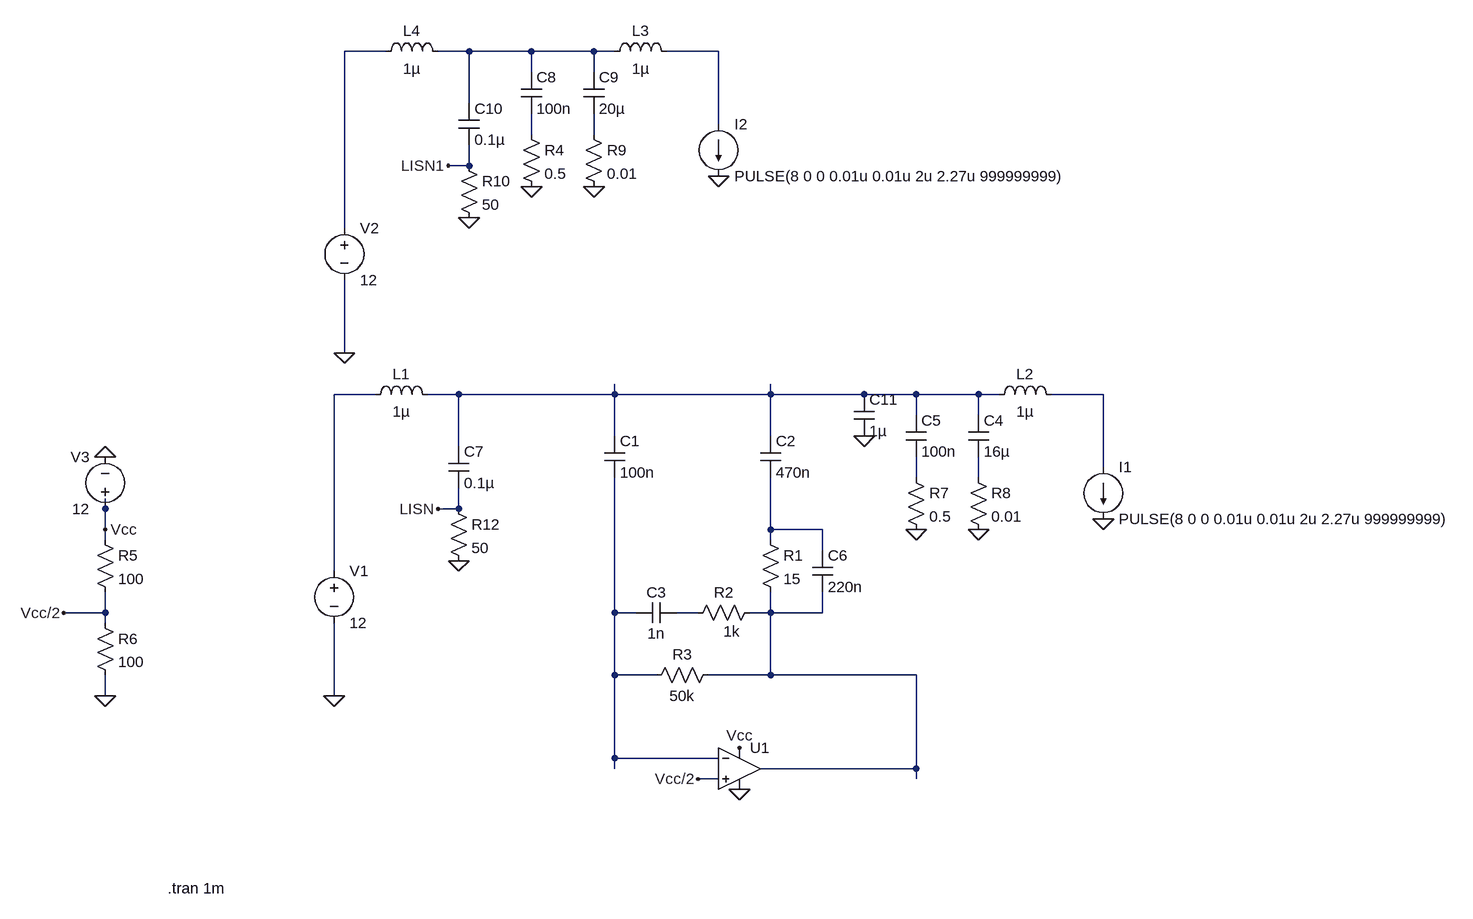
[diagram p0: schematic 440kHz.asc]
440kHz.asc, the LTspice schematic file:
Version 4
SHEET 1 3444 680
WIRE -320 -656 -384 -656
WIRE -192 -656 -240 -656
WIRE -96 -656 -192 -656
WIRE 0 -656 -96 -656
WIRE 32 -656 0 -656
WIRE 192 -656 112 -656
WIRE -96 -624 -96 -656
WIRE 0 -624 0 -656
WIRE -192 -576 -192 -656
WIRE 192 -544 192 -656
WIRE -96 -528 -96 -560
WIRE 0 -528 0 -560
WIRE -192 -480 -192 -512
WIRE -192 -480 -224 -480
WIRE -384 -384 -384 -656
WIRE -384 -192 -384 -304
WIRE -336 -128 -400 -128
WIRE -208 -128 -256 -128
WIRE 32 -128 32 -144
WIRE 32 -128 -208 -128
WIRE 272 -128 272 -144
WIRE 272 -128 32 -128
WIRE 416 -128 272 -128
WIRE 496 -128 416 -128
WIRE 592 -128 496 -128
WIRE 624 -128 592 -128
WIRE 784 -128 704 -128
WIRE 496 -96 496 -128
WIRE 592 -96 592 -128
WIRE 32 -64 32 -128
WIRE 272 -64 272 -128
WIRE -208 -48 -208 -128
WIRE 784 -16 784 -128
WIRE 496 0 496 -32
WIRE 592 0 592 -32
WIRE -752 48 -752 32
WIRE -208 48 -208 16
WIRE -208 48 -240 48
WIRE -752 80 -752 48
WIRE 272 80 272 0
WIRE 352 80 272 80
WIRE -752 96 -752 80
WIRE 272 96 272 80
WIRE 352 112 352 80
WIRE -400 144 -400 -128
WIRE -752 208 -752 176
WIRE -752 208 -816 208
WIRE 32 208 32 0
WIRE 64 208 32 208
WIRE 160 208 128 208
WIRE 272 208 272 176
WIRE 272 208 240 208
WIRE 352 208 352 176
WIRE 352 208 272 208
WIRE -752 224 -752 208
WIRE 32 304 32 208
WIRE 96 304 32 304
WIRE 272 304 272 208
WIRE 272 304 176 304
WIRE 496 304 272 304
WIRE -752 336 -752 304
WIRE -400 336 -400 224
WIRE 32 432 32 304
WIRE 192 432 32 432
WIRE 32 448 32 432
WIRE 496 448 496 304
WIRE 496 448 256 448
WIRE 192 464 160 464
WIRE 496 464 496 448
FLAG -400 336 0
FLAG -816 208 Vcc/2
FLAG -752 336 0
FLAG 496 80 0
FLAG -752 80 Vcc
FLAG 224 416 Vcc
FLAG 160 464 Vcc/2
FLAG 224 480 0
FLAG -752 -32 0
FLAG -208 128 0
FLAG -240 48 LISN
FLAG 784 64 0
FLAG 592 80 0
FLAG -96 -448 0
FLAG 192 -464 0
FLAG 0 -448 0
FLAG -384 -192 0
FLAG -192 -400 0
FLAG -224 -480 LISN1
FLAG 416 -64 0
DATAFLAG 128 -128 ""
DATAFLAG 400 -128 ""
DATAFLAG 752 -128 ""
DATAFLAG 752 -128 ""
DATAFLAG 160 -656 ""
DATAFLAG 160 -656 ""
SYMBOL cap 16 -64 R0
SYMATTR InstName C1
SYMATTR Value 100n
SYMBOL cap 256 -64 R0
SYMATTR InstName C2
SYMATTR Value 470n
SYMBOL res 256 80 R0
SYMATTR InstName R1
SYMATTR Value 15
SYMBOL cap 128 192 R90
WINDOW 0 0 32 VBottom 2
WINDOW 3 32 32 VTop 2
SYMATTR InstName C3
SYMATTR Value 1n
SYMBOL res 256 192 R90
WINDOW 0 0 56 VBottom 2
WINDOW 3 29 44 VTop 2
SYMATTR InstName R2
SYMATTR Value 1k
SYMBOL res 192 288 R90
WINDOW 0 0 56 VBottom 2
WINDOW 3 32 56 VTop 2
SYMATTR InstName R3
SYMATTR Value 50k
SYMBOL res -768 80 R0
SYMATTR InstName R5
SYMATTR Value 100
SYMBOL res -768 208 R0
SYMATTR InstName R6
SYMATTR Value 100
SYMBOL res 480 -16 R0
SYMATTR InstName R7
SYMATTR Value 0.5
SYMBOL voltage -400 128 R0
WINDOW 123 0 0 Left 0
WINDOW 39 24 124 Left 2
SYMATTR InstName V1
SYMATTR Value 12
SYMBOL ind -352 -112 R270
WINDOW 0 32 56 VTop 2
WINDOW 3 5 56 VBottom 2
SYMATTR InstName L1
SYMATTR Value 1µ
SYMBOL voltage -752 64 R180
WINDOW 0 24 96 Left 2
WINDOW 3 24 16 Left 2
WINDOW 123 0 0 Left 0
WINDOW 39 0 0 Left 0
SYMATTR InstName V3
SYMATTR Value 12
SYMBOL cap 480 -96 R0
SYMATTR InstName C5
SYMATTR Value 100n
SYMBOL ind 608 -112 R270
WINDOW 0 32 56 VTop 2
WINDOW 3 5 56 VBottom 2
SYMATTR InstName L2
SYMATTR Value 1µ
SYMBOL cap -224 -48 R0
SYMATTR InstName C7
SYMATTR Value 0.1µ
SYMBOL res -224 32 R0
SYMATTR InstName R12
SYMATTR Value 50
SYMBOL OpAmps\\UniversalOpamp2 224 448 R0
SYMATTR InstName U1
SYMATTR Value2 Avol=10Meg GBW=100Meg Slew=100Meg
SYMATTR SpiceLine ilimit=10 rail=0 Vos=0 phimargin=45
SYMBOL cap 336 112 R0
SYMATTR InstName C6
SYMATTR Value 220n
SYMBOL current 784 -16 R0
WINDOW 123 0 0 Left 0
WINDOW 39 0 0 Left 0
SYMATTR InstName I1
SYMATTR Value PULSE(8 0 0 0.01u 0.01u 2u 2.27u 999999999)
SYMBOL cap 576 -96 R0
SYMATTR InstName C4
SYMATTR Value 16µ
SYMBOL res 576 -16 R0
SYMATTR InstName R8
SYMATTR Value 0.01
SYMBOL res -112 -544 R0
SYMATTR InstName R4
SYMATTR Value 0.5
SYMBOL cap -112 -624 R0
SYMATTR InstName C8
SYMATTR Value 100n
SYMBOL ind 16 -640 R270
WINDOW 0 32 56 VTop 2
WINDOW 3 5 56 VBottom 2
SYMATTR InstName L3
SYMATTR Value 1µ
SYMBOL current 192 -544 R0
WINDOW 123 0 0 Left 0
WINDOW 39 0 0 Left 0
SYMATTR InstName I2
SYMATTR Value PULSE(8 0 0 0.01u 0.01u 2u 2.27u 999999999)
SYMBOL cap -16 -624 R0
SYMATTR InstName C9
SYMATTR Value 20µ
SYMBOL res -16 -544 R0
SYMATTR InstName R9
SYMATTR Value 0.01
SYMBOL voltage -384 -400 R0
WINDOW 123 0 0 Left 0
WINDOW 39 24 124 Left 2
SYMATTR InstName V2
SYMATTR Value 12
SYMBOL ind -336 -640 R270
WINDOW 0 32 56 VTop 2
WINDOW 3 5 56 VBottom 2
SYMATTR InstName L4
SYMATTR Value 1µ
SYMBOL cap -208 -576 R0
SYMATTR InstName C10
SYMATTR Value 0.1µ
SYMBOL res -208 -496 R0
SYMATTR InstName R10
SYMATTR Value 50
SYMBOL cap 400 -128 R0
SYMATTR InstName C11
SYMATTR Value 1µ
TEXT -656 632 Left 2 !.tran 1m

The netlist it stands for:
* 440kHz.asc
C1 N007 N012 100n
C2 N007 N011 470n
R1 N011 N014 15
C3 N013 N012 1n
R2 N014 N013 1k
R3 N014 N012 50k
R5 Vcc Vcc/2 100
R6 Vcc/2 0 100
R7 N009 0 0.5
V1 N006 0 12
L1 N006 N007 1µ
V3 Vcc 0 12
C5 N007 N009 100n
L2 N007 N008 1µ
C7 N007 LISN 0.1µ
R12 LISN 0 50
XU1 Vcc/2 N012 Vcc 0 N014 level.2 Avol=10Meg GBW=100Meg Slew=100Meg ilimit=10 rail=0 Vos=0 phimargin=45 en=0 enk=0 in=0 ink=0 Rin=500Meg  ; pins IN+ IN- V+ V- OUT
C6 N011 N014 220n
I1 N008 0 PULSE(8 0 0 0.01u 0.01u 2u 2.27u 999999999)
C4 N007 N010 16µ
R8 N010 0 0.01
R4 N004 0 0.5
C8 N002 N004 100n
L3 N002 N003 1µ
I2 N003 0 PULSE(8 0 0 0.01u 0.01u 2u 2.27u 999999999)
C9 N002 N005 20µ
R9 N005 0 0.01
V2 N001 0 12
L4 N001 N002 1µ
C10 N002 LISN1 0.1µ
R10 LISN1 0 50
C11 N007 0 1µ
.tran 1m
.lib UniversalOpamps2.sub
.backanno
.end